# EasyEDA Pro project esp32-c3.eprj

# Schematic Main_sheet
Create Date: 2023-10-18; Page Name: P1; Project Name: esp32-c3; Schematic Name: Main_sheet; Update Date: 2023-10-30; Company: EasyEDA.com; Drawed: EasyEDA Pro; Page Size: A3; Part Number: JLCPCB-002; Reviewed: EasyEDA Pro; Version: V0.2
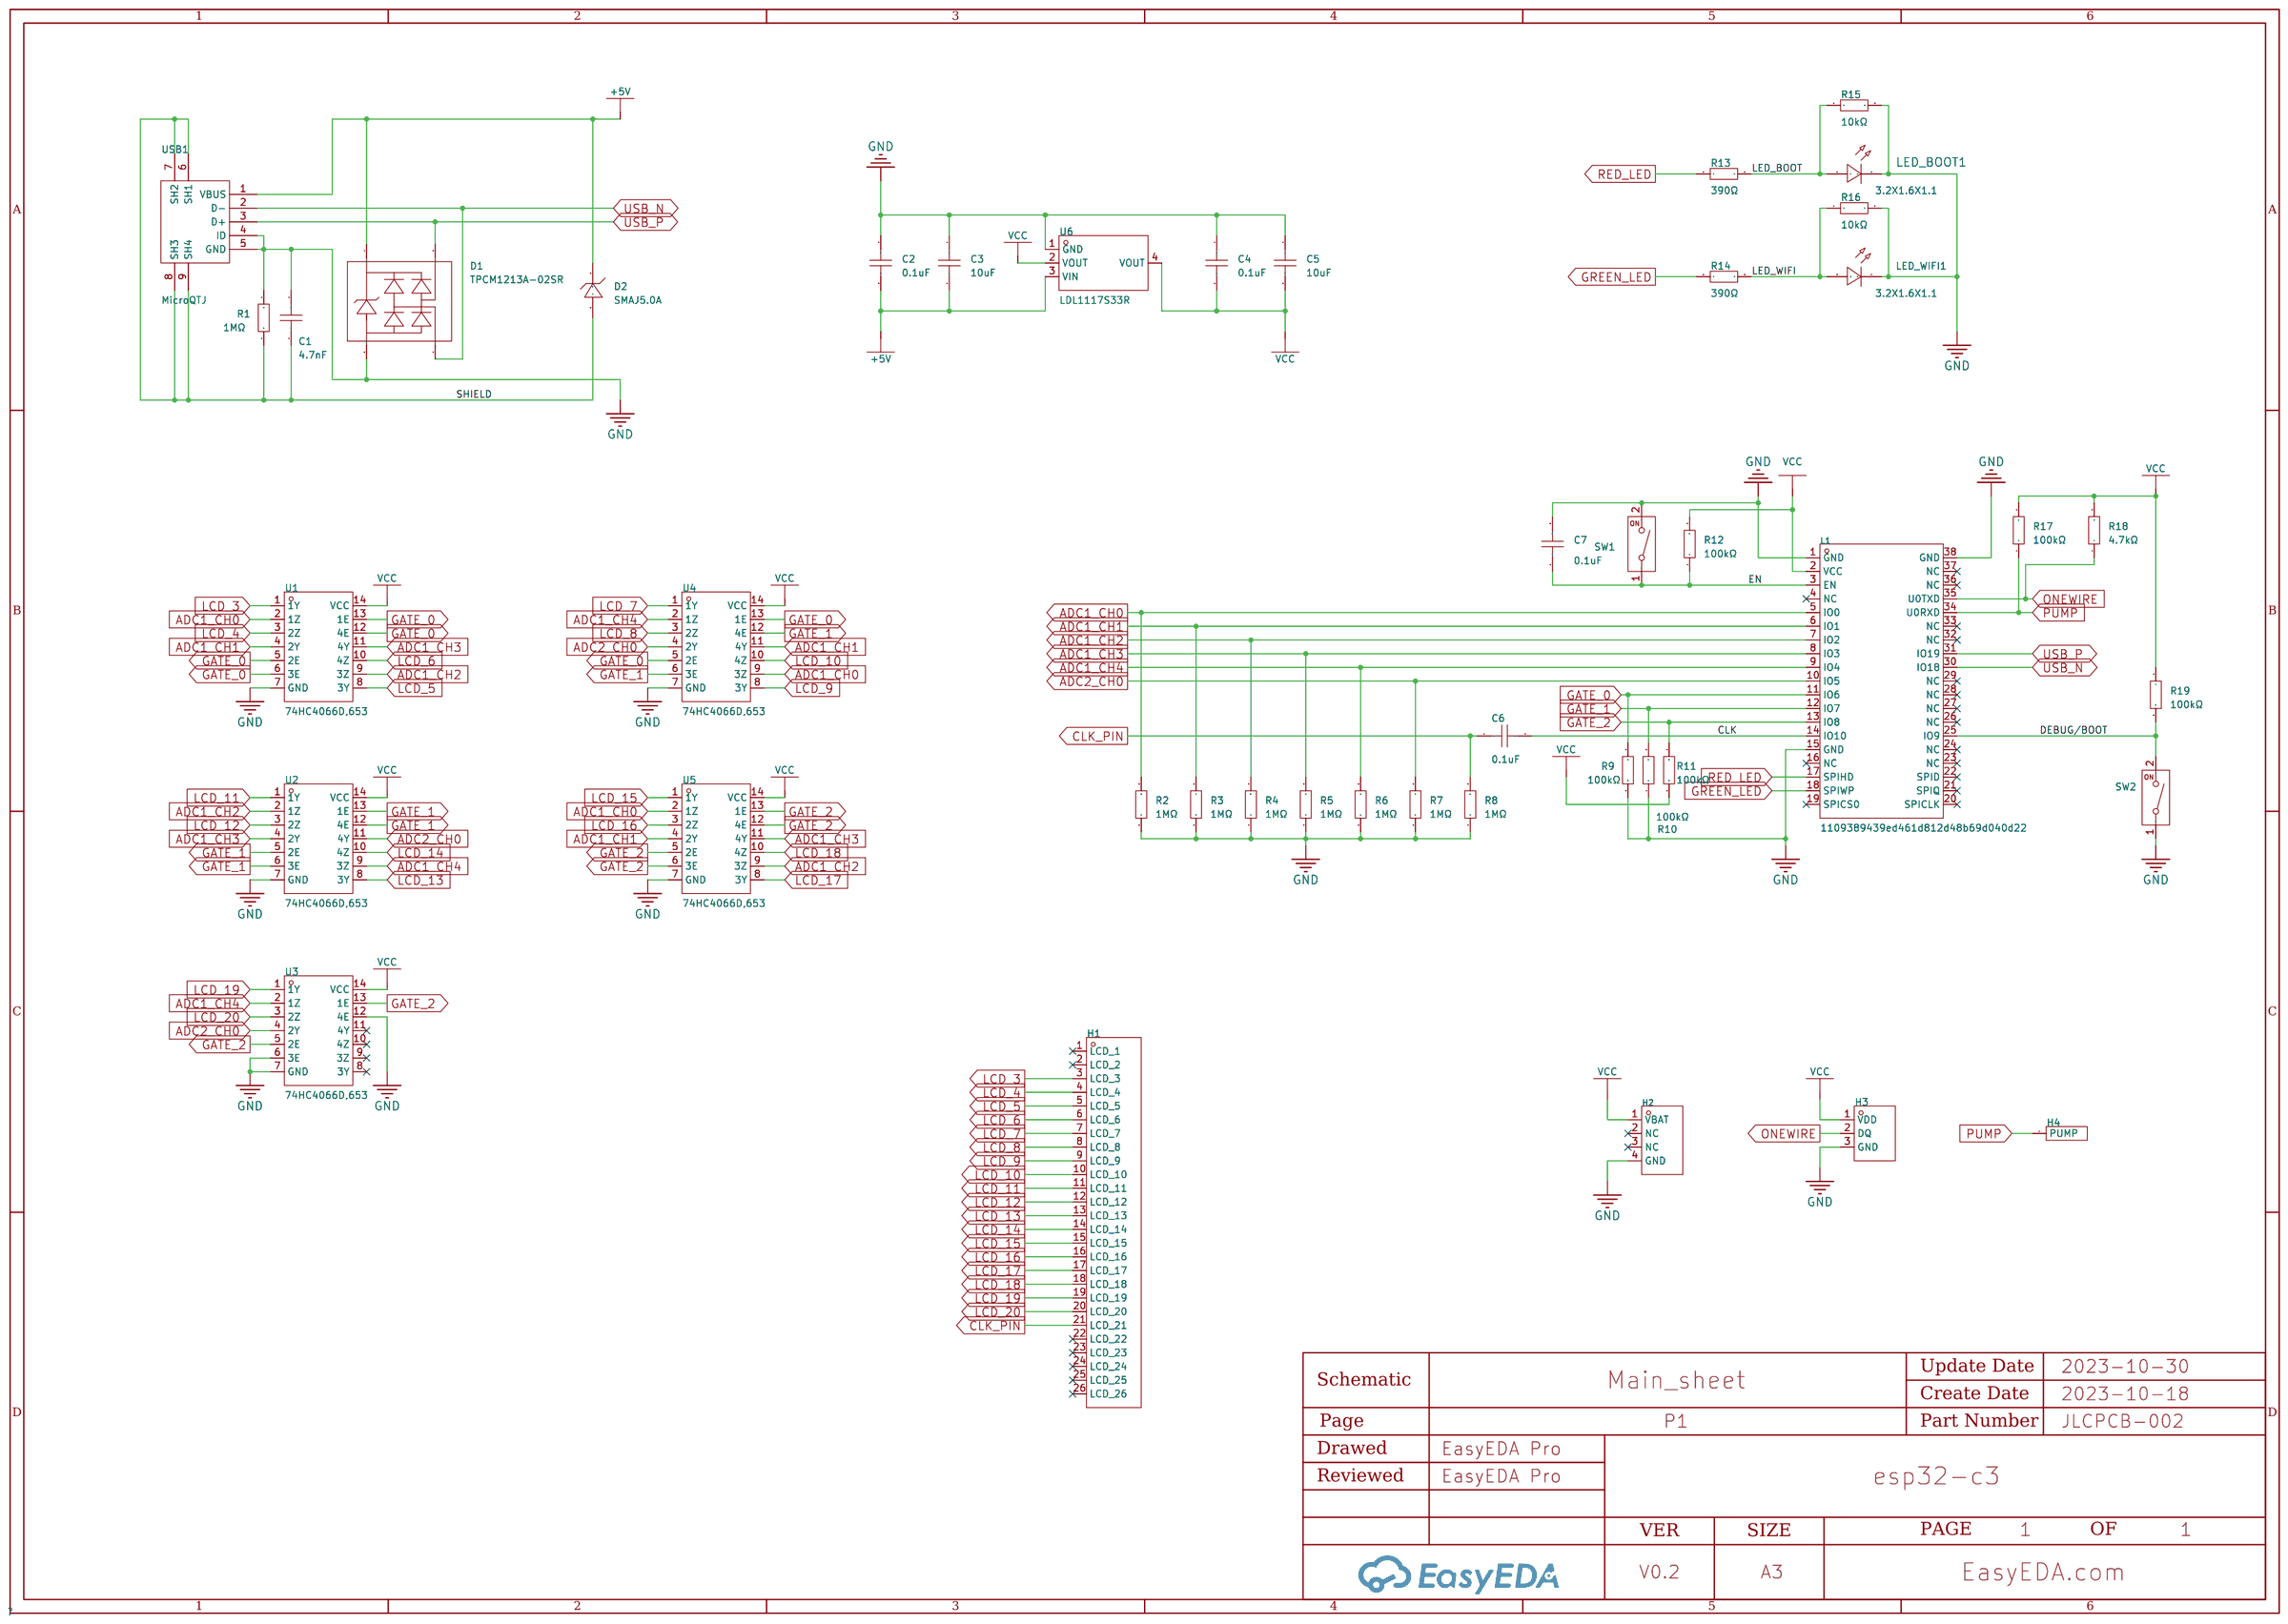
[diagram p0: schematic sheet]

## Parts
C1  4.7nF  [C0805]
C2  0.1uF  [C1206]
C3  10uF  [C1206]
C4  0.1uF  [C1206]
C5  10uF  [C1206]
C6  0.1uF  [C1206]
C7  0.1uF  [C1206]
D1  TPCM1213A-02SR  [SOT-143-4_L2.9-W1.3-P1.90-LS2.4-BL]
D2  SMAJ5.0A  [SMA_L4.3-W2.6-LS5.2-RD]
H1  -  [LCD_26_FOOT]
H2  -  [HDR-M-2.54_1X4]
H3  -  [HDR-TH_3P-P2.54-V-M]
H4  -  [HDR-TH_1P-V-M_XKB_X4611WV-01I-C28D40]
L1  2.4GHz  [WIRELM-SMD_ESP-C3-32S-4M]
LED_BOOT1  3.2X1.6X1.1  [LED1206-R-RD_BLUE]
LED_WIFI1  3.2X1.6X1.1  [LED1206-R-RD_BLUE]
R1  1MΩ  [R1206]
R2  1MΩ  [R1206]
R3  1MΩ  [R1206]
R4  1MΩ  [R1206]
R5  1MΩ  [R1206]
R6  1MΩ  [R1206]
R7  1MΩ  [R1206]
R8  1MΩ  [R1206]
R9  100kΩ  [R1206]
R10  100kΩ  [R1206]
R11  100kΩ  [R1206]
R12  100kΩ  [R1206]
R13  390Ω  [R1206]
R14  390Ω  [R1206]
R15  10kΩ  [R1206]
R16  10kΩ  [R1206]
R17  100kΩ  [R1206]
R18  4.7kΩ  [R1206]
R19  100kΩ  [R1206]
SW1  RESET  [KEY-SMD_L6.1-W3.7-P7.80-LS8.0]
SW2  BOOT  [KEY-SMD_L6.1-W3.7-P7.80-LS8.0]
U1  74HC4066D,653  [SOIC-14_L8.7-W3.9-P1.27-LS6.0-BL]
U2  74HC4066D,653  [SOIC-14_L8.7-W3.9-P1.27-LS6.0-BL]
U3  74HC4066D,653  [SOIC-14_L8.7-W3.9-P1.27-LS6.0-BL]
U4  74HC4066D,653  [SOIC-14_L8.7-W3.9-P1.27-LS6.0-BL]
U5  74HC4066D,653  [SOIC-14_L8.7-W3.9-P1.27-LS6.0-BL]
U6  LDL1117S33R  [SOT-223-4_L6.5-W3.5-P2.30-LS7.0-BR]
USB1  MicroQTJ  [MICRO-USB-SMD_MICROQTJ]

## Library data of the parts
C1 = CAP_0805: Supplier Footprint: 0805
C2-C7 = CL31B102KGFNNNE: Capacitance: Tolerance:±10% Tolerance:±10% Voltage Rated: Temperature Coefficient:; LCSC Part Name: 1nF ±10% 500V; Supplier Part: C35216; Manufacturer: SAMSUNG(三星); Supplier Footprint: 1206; JLCPCB Part Class: Basic Part; Datasheet: https://atta.szlcsc.com/upload/public/pdf/source/20160103/1457707723755.pdf; Supplier: LCSC; Tolerance: ±10%
D1 = TPCM1213A-02SR: Supplier Part: C2901319; Manufacturer: TECH PUBLIC(台舟); Supplier Footprint: SOT-143-4; JLCPCB Part Class: Extended Part; Datasheet: https://atta.szlcsc.com/upload/public/pdf/source/20210923/E31203B60B9CAA3EB6A305435044562D.pdf; Supplier: LCSC
D2 = SMAJ5.0A: Supplier Part: C132575; Supplier Footprint: SMA(DO-214AC); JLCPCB Part Class: Extended Part; Datasheet: https://atta.szlcsc.com/upload/public/pdf/source/20170920/C132575_1505895080557980842.pdf; Supplier: LCSC
H1 = LCD_26
H2 = MOTHER_PLATE_CONNECTOR: Supplier Footprint: Through; Supplier: LCSC; Supplier Part: C492403; Manufacturer: XFCN(兴飞); Manufacturer Part: PZ254V-11-04P; JLCPCB Part Class: Extended Part
H3 = DS18B20_FOOT: Supplier Footprint: Through
H4 = PUMP_PIN: Supplier Footprint: Through
L1 = ESP-C3-32S-2M: Frequency:2.4GHz Output Power:18dBm Output Power:18dBm Core Processor:ESP32-C3 Support Interface:I2C；GPIO；UART；PWM；ADC；I2S Antenna Type:板载PCBAntenna Wireless Standard:WiFi模块 Operating Voltage:3.3V Operating Voltage:3.3V Receive  Current:93mA Send  Current; Supplier Part: C2847301; Manufacturer: Ai-Thinker(安信可); Supplier Footprint: SMD; JLCPCB Part Class: Extended Part; Datasheet: https://atta.szlcsc.com/upload/public/pdf/source/20210915/A450D83CA4F76ABE67DA30A725EB1B8D.pdf; Supplier: LCSC; Output Power: 18dBm; Core Processor: ESP32-C3; Support Interface: I2C；GPIO；UART；PWM；ADC；I2S; Antenna Type: 板载PCBAntenna; Wireless Standard: WiFi模块; Operating Voltage: 3.3V; Receive  Current: 93mA; Send  Current: 350mA; Sensitivity: -96dBm; Operating Temperature: -40℃~+85℃
LED_BOOT1 LED_WIFI1 = 3.2X1.6X1.1: Supplier Part: C9900001284; Supplier Footprint: LED1206; JLCPCB Part Class: Extended Part; Datasheet: https://atta.szlcsc.comnull; Supplier: LCSC
R1-R19 = Res_1206: Supplier Footprint: 1206
SW1 SW2 = KAN0441C-0252B1: Contact Current:50mA Voltage Rating (DC):12V Circuit:SPST Mounting Style:Brick nogging Actuator Style:Rectangle button With Lamp:- Mechanical Life:- Switch Length:6.1mm Switch Width:3.7mm Switch Height:2.5mm; LCSC Part Name: 6.1*3.7*2.5mm 立贴 轻触开关; Supplier Part: C231731; Manufacturer: GANGYUAN(港源); Supplier Footprint: SMD; JLCPCB Part Class: Extended Part; Datasheet: https://atta.szlcsc.com/upload/public/pdf/source/20180622/C231731_BF6D47E8048436EC370D56E07B4E107C.pdf; Supplier: LCSC; Contact Current: 50mA; Voltage Rating (DC): 12V; Circuit: SPST; Mounting Style: Brick nogging; Actuator Style: Rectangle button; Switch Length: 6.1mm; Switch Width: 3.7mm; Switch Height: 2.5mm
U1-U5 = 74HC4066D,653: Supplier Part: C5628; Manufacturer: Nexperia(安世); Supplier Footprint: SOIC-14-150mil; JLCPCB Part Class: Extended Part; Datasheet: https://atta.szlcsc.com/upload/public/pdf/source/20131112/1457706660412.pdf; Supplier: LCSC
U6 = LDL1117S33R: Output Type: Output Polarity:Positive Number of Outputs:1 Maximum Input Voltage:18V Output Voltage:3.3V~3.3V Output Voltage:3.3V~3.3V Dropout Voltage:600mV@(1.2A) Output Current:1.2A Power Supply Rejection Ratio (PSRR):87dB@(120Hz),65dB@(100kHz); LCSC Part Name: 输入18V 输出3.3V 1.2A; Supplier Part: C435835; Manufacturer: ST(意法半导体); Supplier Footprint: SOT-223-4; JLCPCB Part Class: Extended Part; Datasheet: https://atta.szlcsc.com/upload/public/pdf/source/20191009/C435835_A59AAEE372646CA19274A9A6CBE87923.pdf; Supplier: LCSC; Output Polarity: Positive; Number of Outputs: 1; Maximum Input Voltage: 18V; Output Voltage: 3.3V~3.3V; Dropout Voltage: 600mV@(1.2A); Output Current: 1.2A; Power Supply Rejection Ratio (PSRR): 87dB@(120Hz),65dB@(100kHz)
USB1 = MicroQTJ: Connector Type:Micro-B Standard:USB 2.0 Gender:Female Number of Contacts:5 Number of Ports:1 Mounting Style:Surface Mount Current Rating - Power (Max):- Operating Temperature Range:-30℃~+80℃ Operating Temperature Range:-30℃~+80℃; LCSC Part Name: Micro USB 母座 5P 全贴有柱; Supplier Part: C404968; Manufacturer: SHOU HAN(首韩); Supplier Footprint: SMD; JLCPCB Part Class: Extended Part; Supplier: LCSC; Connector Type: Micro-B; Standard: USB 2.0; Gender: Female; Number of Contacts: 5; Number of Ports: 1; Mounting Style: Surface Mount; Operating Temperature Range: -30℃~+80℃

## Nets
+5V: C2.2 C3.2 D1.4 D2.1(C) U6.3(VIN) USB1.1(VBUS)
GND: C1.1 C2.1 C3.1 C4.1 C5.1 C7.2 D1.1 H2.4(GND) H3.3(GND) L1.1(GND) L1.15(GND) L1.38(GND) LED_BOOT1.2(C) LED_WIFI1.1(C) R1.1 R2.1 R3.1 R4.1 R5.1 R6.1 R7.1 R8.1 R9.1 R10.1 R15.2 R16.2 SW1.2 SW2.1 U1.7(GND) U2.7(GND) U3.6(3E) U3.7(GND) U3.12(4E) U4.7(GND) U5.7(GND) U6.1(GND) USB1.4(ID) USB1.5(GND)
VCC: C4.2 C5.2 H2.1(VBAT) H3.1(VDD) L1.2(VCC) R11.1 R12.2 R17.2 R18.2 R19.1 U1.14(VCC) U2.14(VCC) U3.14(VCC) U4.14(VCC) U5.14(VCC) U6.2(VOUT) U6.4(VOUT)
ADC1_CH0: L1.5(IO0) R2.2 U1.2(1Z) U4.9(3Z) U5.2(1Z)
ADC1_CH1: L1.6(IO1) R3.2 U1.4(2Y) U4.11(4Y) U5.4(2Y)
ADC1_CH2: L1.7(IO2) R4.2 U1.9(3Z) U2.2(1Z) U5.9(3Z)
ADC1_CH3: L1.8(IO3) R5.2 U1.11(4Y) U2.4(2Y) U5.11(4Y)
ADC1_CH4: L1.9(IO4) R6.2 U2.9(3Z) U3.2(1Z) U4.2(1Z)
ADC2_CH0: L1.10(IO5) R7.2 U2.11(4Y) U3.4(2Y) U4.4(2Y)
CLK: C6.2 L1.14(IO10)
CLK_PIN: C6.1 H1.21(LCD) R8.2
DEBUG/BOOT: L1.25(IO9) R19.2 SW2.2
EN: C7.1 L1.3(EN) R12.1 SW1.1
GATE_0: L1.11(IO6) R9.2 U1.5(2E) U1.6(3E) U1.12(4E) U1.13(1E) U4.5(2E) U4.13(1E)
GATE_1: L1.12(IO7) R10.2 U2.5(2E) U2.6(3E) U2.12(4E) U2.13(1E) U4.6(3E) U4.12(4E)
GATE_2: L1.13(IO8) R11.2 U3.5(2E) U3.13(1E) U5.5(2E) U5.6(3E) U5.12(4E) U5.13(1E)
GREEN_LED: L1.18(SPIWP) R14.1
LCD_3: H1.3(LCD) U1.1(1Y)
LCD_4: H1.4(LCD) U1.3(2Z)
LCD_5: H1.5(LCD) U1.8(3Y)
LCD_6: H1.6(LCD) U1.10(4Z)
LCD_7: H1.7(LCD) U4.1(1Y)
LCD_8: H1.8(LCD) U4.3(2Z)
LCD_9: H1.9(LCD) U4.8(3Y)
LCD_10: H1.10(LCD) U4.10(4Z)
LCD_11: H1.11(LCD) U2.1(1Y)
LCD_12: H1.12(LCD) U2.3(2Z)
LCD_13: H1.13(LCD) U2.8(3Y)
LCD_14: H1.14(LCD) U2.10(4Z)
LCD_15: H1.15(LCD) U5.1(1Y)
LCD_16: H1.16(LCD) U5.3(2Z)
LCD_17: H1.17(LCD) U5.8(3Y)
LCD_18: H1.18(LCD) U5.10(4Z)
LCD_19: H1.19(LCD) U3.1(1Y)
LCD_20: H1.20(LCD) U3.3(2Z)
LED_BOOT: LED_BOOT1.1(A) R13.2 R15.1
LED_WIFI: LED_WIFI1.2(A) R14.2 R16.1
ONEWIRE: H3.2(DQ) L1.35(U0TXD) R18.1
PUMP: H4.1(PUMP) L1.34(U0RXD) R17.1
RED_LED: L1.17(SPIHD) R13.1
SHIELD: C1.2 D2.2(A) R1.2 USB1.6(SH1) USB1.7(SH2) USB1.8(SH3) USB1.9(SH4)
USB_N: D1.2 L1.30(IO18) USB1.2(D-)
USB_P: D1.3 L1.31(IO19) USB1.3(D+)

Not connected (* = marked no-connect by the designer): H1 1(LCD)* 2(LCD)* 22(LCD)* 23(LCD)* 24(LCD)* 25(LCD)* 26(LCD)*; H2 2(NC)* 3(NC)*; L1 4(NC)* 16(NC)* 19(SPICS0)* 20(SPICLK)* 21(SPIQ)* 22(SPID)* 23(NC)* 24(NC)* 26(NC)* 27(NC)* 28(NC)* 29(NC)* 32(NC)* 33(NC)* 36(NC)* 37(NC)*; U3 8(3Y)* 9(3Z)* 10(4Z)* 11(4Y)*

# Board Main_PCB
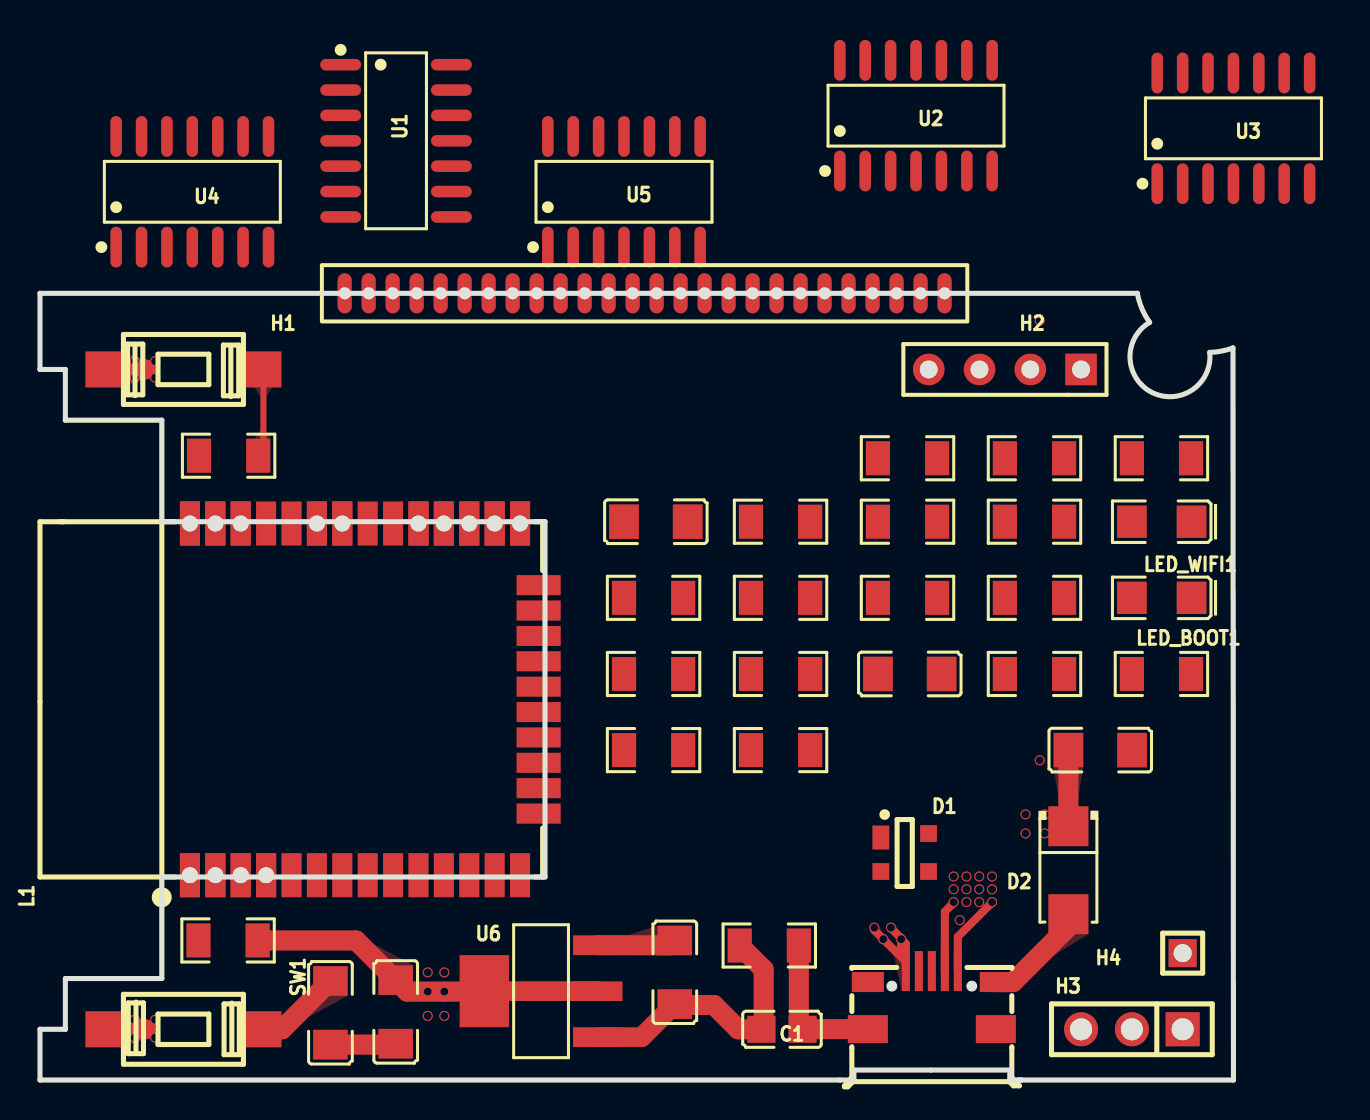
[diagram p1: board, top side]
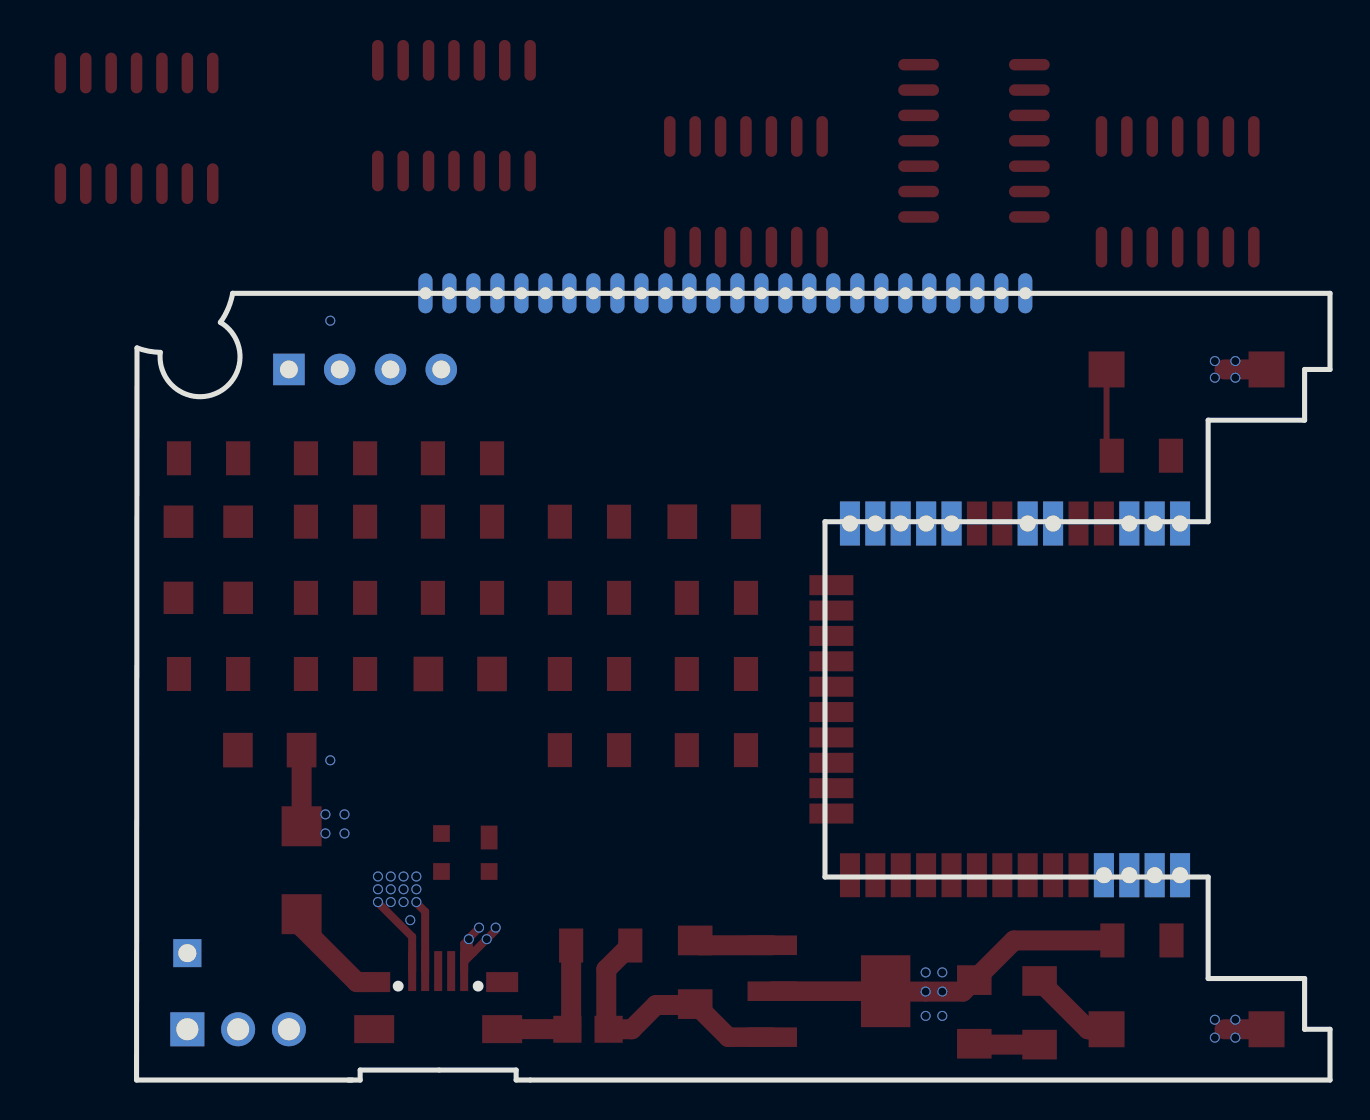
[diagram p2: board, bottom side, seen from below]

Outline 59.69 x 39.37 mm; copper layers: Top Layer, Bottom Layer. Coordinates in mm from the lower left corner of the outline.
Outline path: 40,0 0,0 0,2.54 1.27,2.54 1.27,5.08 6.09,5.08 6.09,10.16 25.26,10.16 25.26,27.94 6.09,27.94 6.09,33.02 1.27,33.02 1.27,35.56 0,35.56 0,39.37 54.88,39.37 arc(55.11,38.61) 55.5,37.92 arc(55.62,34.41) 58.5,36.41 arc(59.09,36.48) 59.67,36.64 59.69,0 48.89,0
Stack: Top Layer 0.035mm / Dielectric1 1.51mm FR4 er 4.5 / Bottom Layer 0.035mm

## Design rules (mm)
net USB_N: DP1
net USB_P: DP1
template: Custom Config
spacing copperThickness1oz (default): track to track 0.102, other pairs 0.152 to 0.3
spacing copperThickness2oz: track to track 0.203, other pairs 0.152 to 0.3
track width copperThickness1oz (default): min 0.254, default 0.254, max 2.54
track width copperThickness2oz: min 0.254, default 0.254, max 2.54
differential pair differentialPair (default): width min 0.254, default 0.254, max 2.54; gap min 0.178, default 0.178
via viaSize (default): diameter min 0.4, default 0.5, max 10; hole min 0.3, default 0.4, max 6.299
pour e4697 uses nonSpokeCopperRegion

## Placement (name value [footprint] x y rotation side)
C1  4.7nF  [C0805]  37.11 2.54 0 top
C2  0.1uF  [C1206]  53.03 16.51 180 top
C3  10uF  [C1206]  31.75 5.39 90 top
C4  0.1uF  [C1206]  17.79 3.41 90 top
C5  10uF  [C1206]  43.5 20.32 0 top
C6  0.1uF  [C1206]  30.8 27.94 180 top
C7  0.1uF  [C1206]  14.53 3.36 270 top
D1  TPCM1213A-02SR  [SOT-143-4_L2.9-W1.3-P1.90-LS2.4-BL]  43.25 11.39 270 top
D2  SMAJ5.0A  [SMA_L4.3-W2.6-LS5.2-RD]  51.44 10.5 270 top
H1  -  [LCD_26_FOOT]  15.24 39.37 0 top
H2  -  [HDR-M-2.54_1X4]  48.26 35.56 180 top
H3  -  [HDR-TH_3P-P2.54-V-M]  54.61 2.54 180 top
H4  -  [HDR-TH_1P-V-M_XKB_X4611WV-01I-C28D40]  57.15 6.35 0 top
L1  2.4GHz  [WIRELM-SMD_ESP-C3-32S-4M]  16.22 19.05 90 top
LED_BOOT1  3.2X1.6X1.1  [LED1206-R-RD_BLUE]  56.1 24.13 180 top
LED_WIFI1  3.2X1.6X1.1  [LED1206-R-RD_BLUE]  56.1 27.94 180 top
NOREF  -  [Pad_e106]  22.74 27.85 90 top
NOREF#2  -  [Pad_e128]  11.31 10.25 270 top
NOREF#3  -  [Pad_e90]  8.77 27.85 90 top
NOREF#4  -  [Pad_e131]  7.5 10.25 270 top
NOREF#5  -  [Pad_e130]  8.77 10.25 270 top
NOREF#6  -  [Pad_e105]  21.47 27.85 90 top
NOREF#7  -  [Pad_e97]  13.85 27.85 90 top
NOREF#8  -  [Pad_e129]  10.04 10.25 270 top
NOREF#9  -  [Pad_e99]  15.12 27.85 90 top
NOREF#10  -  [Pad_e88]  7.5 27.85 90 top
NOREF#11  -  [Pad_e107]  24.01 27.85 90 top
NOREF#12  -  [Pad_e92]  10.04 27.85 90 top
NOREF#13  -  [Pad_e104]  20.2 27.85 90 top
NOREF#14  -  [Pad_e103]  18.93 27.85 90 top
R1  1MΩ  [R1206]  36.47 6.73 0 top
R2  1MΩ  [R1206]  30.69 20.32 180 top
R3  1MΩ  [R1206]  30.69 16.51 180 top
R4  1MΩ  [R1206]  30.69 24.13 0 top
R5  1MΩ  [R1206]  37.04 24.13 180 top
R6  1MΩ  [R1206]  37.04 20.32 180 top
R7  1MΩ  [R1206]  37.04 16.51 180 top
R8  1MΩ  [R1206]  37.04 27.94 180 top
R9  100kΩ  [R1206]  43.39 24.13 180 top
R10  100kΩ  [R1206]  43.39 31.12 180 top
R11  100kΩ  [R1206]  43.39 27.94 180 top
R12  100kΩ  [R1206]  9.41 6.99 0 top
R13  390Ω  [R1206]  49.74 27.94 0 top
R14  390Ω  [R1206]  56.09 31.12 0 top
R15  10kΩ  [R1206]  56.09 20.32 0 top
R16  10kΩ  [R1206]  49.74 31.12 0 top
R17  100kΩ  [R1206]  49.74 24.13 180 top
R18  4.7kΩ  [R1206]  49.74 20.32 180 top
R19  100kΩ  [R1206]  9.43 31.24 0 top
SW1  RESET  [KEY-SMD_L6.1-W3.7-P7.80-LS8.0]  7.17 2.54 180 top
SW2  BOOT  [KEY-SMD_L6.1-W3.7-P7.80-LS8.0]  7.17 35.56 0 top
U1  74HC4066D,653  [SOIC-14_L8.7-W3.9-P1.27-LS6.0-BL]  17.81 47 270 top
U2  74HC4066D,653  [SOIC-14_L8.7-W3.9-P1.27-LS6.0-BL]  43.81 48.26 0 top
U3  74HC4066D,653  [SOIC-14_L8.7-W3.9-P1.27-LS6.0-BL]  59.69 47.62 0 top
U4  74HC4066D,653  [SOIC-14_L8.7-W3.9-P1.27-LS6.0-BL]  7.62 44.45 0 top
U5  74HC4066D,653  [SOIC-14_L8.7-W3.9-P1.27-LS6.0-BL]  29.21 44.45 0 top
U6  LDL1117S33R  [SOT-223-4_L6.5-W3.5-P2.30-LS7.0-BR]  25.06 4.45 0 top
USB1  MicroQTJ  [MICRO-USB-SMD_MICROQTJ]  44.6 4 0 top

## Footprints (pads in the part's own frame, mm; a bottom-side part is the same pattern mirrored in y, then rotated)
C0805
  rect 1.41x1.35 smd: 1(-1.03,0) 2(1.03,0)
C1206
  rect 1.485x1.728 smd: 1(-1.593,0) 2(1.593,0)
HDR-M-2.54_1X4
  rect 1.575x1.575 hole 0.889: 1(-3.81,0)
  round 1.575 hole 0.889: 2(-1.27,0) 3(1.27,0) 4(3.81,0)
HDR-TH_1P-V-M_XKB_X4611WV-01I-C28D40
  rect 1.4x1.4 hole 0.9: 1(0,0)
HDR-TH_3P-P2.54-V-M
  rect 1.7x1.7 hole 1.1: 1(-2.54,0)
  round 1.7 hole 1.1: 2(0,0) 3(2.54,0)
KEY-SMD_L6.1-W3.7-P7.80-LS8.0
  rect 1.8x1.8 smd: 1(-4,0) 2(4,0)
LCD_26_FOOT
  oval 0.7x2 hole 0.6: 1(0,0) 2(1.2,0) 3(2.4,0) 4(3.6,0) 5(4.8,0) 6(6,0) 7(7.2,0) 8(8.4,0) 9(9.6,0) 10(10.8,0) 11(12,0) 12(13.2,0) 13(14.4,0) 14(15.6,0) 15(16.8,0) 16(18,0) 17(19.2,0) 18(20.4,0) 19(21.6,0) 20(22.8,0) 21(24,0) 22(25.2,0) 23(26.4,0) 24(27.6,0) 25(28.8,0) 26(30,0)
LED1206-R-RD_BLUE
  rect 1.485x1.62 smd: 1(1.492,0) 2(-1.492,0)
MICRO-USB-SMD_MICROQTJ
  rect 0.4x2 smd: 1(-1.3,1.452) 2(-0.65,1.452) 3(0,1.452) 4(0.65,1.452) 5(1.3,1.452)
  rect 1.6x1 smd: 6(-3.2,0.901) 9(3.2,0.901)
  rect 2x1.4 smd: 7(-3.2,-1.452) 8(3.2,-1.452)
Pad_e88
  rect 2.2x1 hole 0.8: 1(0,0)
Pad_e90
  rect 2.2x1 hole 0.8: 2(0,0)
Pad_e92
  rect 2.2x1 hole 0.8: 3(0,0)
Pad_e97
  rect 2.2x1 hole 0.8: 6(0,0)
Pad_e99
  rect 2.2x1 hole 0.8: 7(0,0)
Pad_e103
  rect 2.2x1 hole 0.8: 10(0,0)
Pad_e104
  rect 2.2x1 hole 0.8: 11(0,0)
Pad_e105
  rect 2.2x1 hole 0.8: 12(0,0)
Pad_e106
  rect 2.2x1 hole 0.8: 13(0,0)
Pad_e107
  rect 2.2x1 hole 0.8: 14(0,0)
Pad_e128
  rect 2.2x1 hole 0.8: 35(0,0)
Pad_e129
  rect 2.2x1 hole 0.8: 36(0,0)
Pad_e130
  rect 2.2x1 hole 0.8: 37(0,0)
Pad_e131
  rect 2.2x1 hole 0.8: 38(0,0)
R1206
  rect 1.208x1.701 smd: 1(-1.479,0) 2(1.479,0)
SMA_L4.3-W2.6-LS5.2-RD
  rect 2x2 smd: 1(-2.2,0) 2(2.2,0)
SOIC-14_L8.7-W3.9-P1.27-LS6.0-BL
  oval 0.574x2.038 smd: 1(-3.81,-2.769) 2(-2.54,-2.769) 3(-1.27,-2.769) 4(0,-2.769) 5(1.27,-2.769) 6(2.54,-2.769) 7(3.81,-2.769) 8(3.81,2.769) 9(2.54,2.769) 10(1.27,2.769) 11(0,2.769) 12(-1.27,2.769) 13(-2.54,2.769) 14(-3.81,2.769)
SOT-143-4_L2.9-W1.3-P1.90-LS2.4-BL
  rect 1.194x0.838 smd: 1(-0.75,-1.192)
  rect 0.838x0.838 smd: 2(0.95,-1.192) 3(0.95,1.192) 4(-0.95,1.192)
SOT-223-4_L6.5-W3.5-P2.30-LS7.0-BR
  rect 2.47x0.98 smd: 1(2.835,-2.3) 2(2.835,0) 3(2.835,2.3)
  rect 2.47x3.6 smd: 4(-2.835,0)
WIRELM-SMD_ESP-C3-32S-4M
  rect 2.2x1 smd: 1(-8.8,8.72) 2(-8.8,7.45) 3(-8.8,6.18) 4(-8.8,4.91) 5(-8.8,3.64) 6(-8.8,2.37) 7(-8.8,1.1) 8(-8.8,-0.17) 9(-8.8,-1.44) 10(-8.8,-2.71) 11(-8.8,-3.98) 12(-8.8,-5.25) 13(-8.8,-6.52) 14(-8.8,-7.79) 25(8.8,-7.79) 26(8.8,-6.52) 27(8.8,-5.25) 28(8.8,-3.98) 29(8.8,-2.71) 30(8.8,-1.44) 31(8.8,-0.17) 32(8.8,1.1) 33(8.8,2.37) 34(8.8,3.64) 35(8.8,4.91) 36(8.8,6.18) 37(8.8,7.45) 38(8.8,8.72)
  rect 1x2.2 smd: 15(-5.715,-8.72) 16(-4.445,-8.72) 17(-3.175,-8.72) 18(-1.905,-8.72) 19(-0.635,-8.72) 20(0.635,-8.72) 21(1.905,-8.72) 22(3.175,-8.72) 23(4.445,-8.72) 24(5.715,-8.72)

## Nets
As in the schematic, except:
GND: C1.1 C2.1 C3.1 C4.1 C5.1 C7.2 D1.1 H2.4 H3.3 L1.1 L1.15 L1.38 LED_BOOT1.2 LED_WIFI1.1 NOREF#4.38 NOREF#10.1 R1.1 R2.1 R3.1 R4.1 R5.1 R6.1 R7.1 R8.1 R9.1 R10.1 R15.2 R16.2 SW1.2 SW2.1 U1.7 U2.7 U3.6 U3.7 U3.12 U4.7 U5.7 U6.1 USB1.4 USB1.5
VCC: C4.2 C5.2 H2.1 H3.1 L1.2 NOREF#5.37 R11.1 R12.2 R17.2 R18.2 R19.1 U1.14 U2.14 U3.14 U4.14 U5.14 U6.2 U6.4
DEBUG/BOOT: L1.25 NOREF#11.14 R19.2 SW2.2
EN: C7.1 L1.3 NOREF#8.36 R12.1 SW1.1

Pads without a net: H1 1 2 22 23 24 25 26; H2 2 3; L1 4 16 19 20 21 22 23 24 26 27 28 29 32 33 36 37; NOREF 13; NOREF#2 35; NOREF#3 2; NOREF#6 12; NOREF#7 6; NOREF#9 7; NOREF#12 3; NOREF#13 11; NOREF#14 10; U3 8 9 10 11

## Via types
v1: diameter 0.5, hole 0.4, Top Layer to Bottom Layer, 37 vias

## Routing (per net, layer and track width the routed paths; a pad name or vN(x,y) marks a point on that pad's centre or on a via; arc(x,y) is an arc through that point)
+5V: length 13.4
  Top Layer w0.4: 42.84,6.38 43.07,6.61 43.07,7.05 ; 42.84,6.38 43.3,5.92 ; 42.84,6.38 41.73,7.5 41.73,7.63 ; 43.07,7.05 43.3,6.82 43.3,5.92 ; 43.07,7.05 43.07,7.09 42.54,7.62 ; 43.3,5.92 USB1.1
  Top Layer w1: C3.2 31.51,6.75 U6.3 ; D2.1 C2.2
  vias: v1(41.73,7.63) v1(42.18,7.05) v1(42.56,7.63) v1(43.07,7.05) v1(49.29,13.29) v1(49.29,12.34) v1(50.24,13.29) v1(50.24,12.34)
GND: length 29.5
  Top Layer w0.4: 47.62,8.89 45.91,7.17 USB1.5 ; USB1.4 45.26,8.43 45.72,8.89
  Top Layer w0.98: C3.1 30.1,2.15 U6.1
  Top Layer w1: SW2.1 5.27,35.56 ; C7.2 17.75,1.77 C4.1 ; C3.1 31.8,3.75 33.71,3.75 34.92,2.54 36.19,2.54 36.19,5.53 R1.1 ; SW1.2 5.27,2.54
  vias: v1(4.74,35.98) v1(4.74,35.15) v1(4.74,3.02) v1(4.74,2.12) v1(5.76,35.98) v1(5.76,35.15) v1(5.76,3.02) v1(5.76,2.12) v1(45.7,10.19) v1(45.7,9.55) v1(45.7,8.91) v1(46,8) v1(46.34,10.19) v1(46.34,9.55) v1(46.34,8.91) v1(46.98,10.19) v1(46.98,9.55) v1(46.98,8.91) v1(47.62,10.19) v1(47.62,9.55) v1(47.62,8.91) v1(50,38) v1(50,16)
VCC: length 17.4
  Top Layer w0.98: U6.2 U6.4
  Top Layer w1: U6.4 22.2,4.42 18.37,4.42 C4.2 15.81,6.99 11.52,6.99
  vias: v1(19.39,5.39) v1(19.39,4.43) v1(19.39,3.21) v1(20.22,5.39) v1(20.22,4.43) v1(20.22,3.21)
DEBUG/BOOT: length 4.4
  Top Layer w0.3: R19.2 11.17,31.5 SW2.2
EN: length 4.4
  Top Layer w1: SW1.1 12.11,2.54 C7.1
SHIELD: length 13
  Top Layer w1: USB1.9 48.67,4.9 51.44,7.67 D2.2 ; USB1.7 38.12,2.55 38.11,2.54 37.95,2.7 R1.2

## Copper pours and planes (outline as drawn; the poured copper is in the pictures)
+5V on Top Layer: 43.06,4.45 43.06,5.72 40,8.26 33.66,8.26 33.17,7.67 33.17,5.41 25.74,5.41 25.74,8.08 29.68,8.08 31.21,9.6 41.68,9.6 43.46,7.83 43.45,4.45
+5V on Bottom Layer: 43.7,8 43.7,7.07 47.54,7.07 48.95,8.48 48.95,13.79 48.96,13.79 50.53,13.79 50.53,8.03 48.09,5.58 42.51,5.58 41.03,7.06 41.03,8
GND on Top Layer: 2.2,3.3 6.17,3.3 6.17,1.78 2.2,1.78
GND on Top Layer: 45.08,10.8 48.26,10.8 48.26,8.89 48.25,8.89 45.91,6.55 45.35,6.55 45.26,6.64 45.26,9.35 45.08,9.53
GND on Top Layer: 2.2,36.32 6.17,36.32 6.17,34.8 2.2,34.8
VCC on Top Layer: 18.94,5.88 21.21,5.88 21.21,2.79 18.94,2.79
VCC on Bottom Layer: 18.94,5.9 20.89,5.9 20.89,2.79 18.94,2.79
SHIELD on Top Layer: 39.86,6.18 49.37,6.18 49.37,0 39.86,0

Small or netless copper shapes (teardrops, artwork), in the pictures only: 23 on Top Layer
